# EAGLE schematic F405Pill (EAGLE 7.5.0)
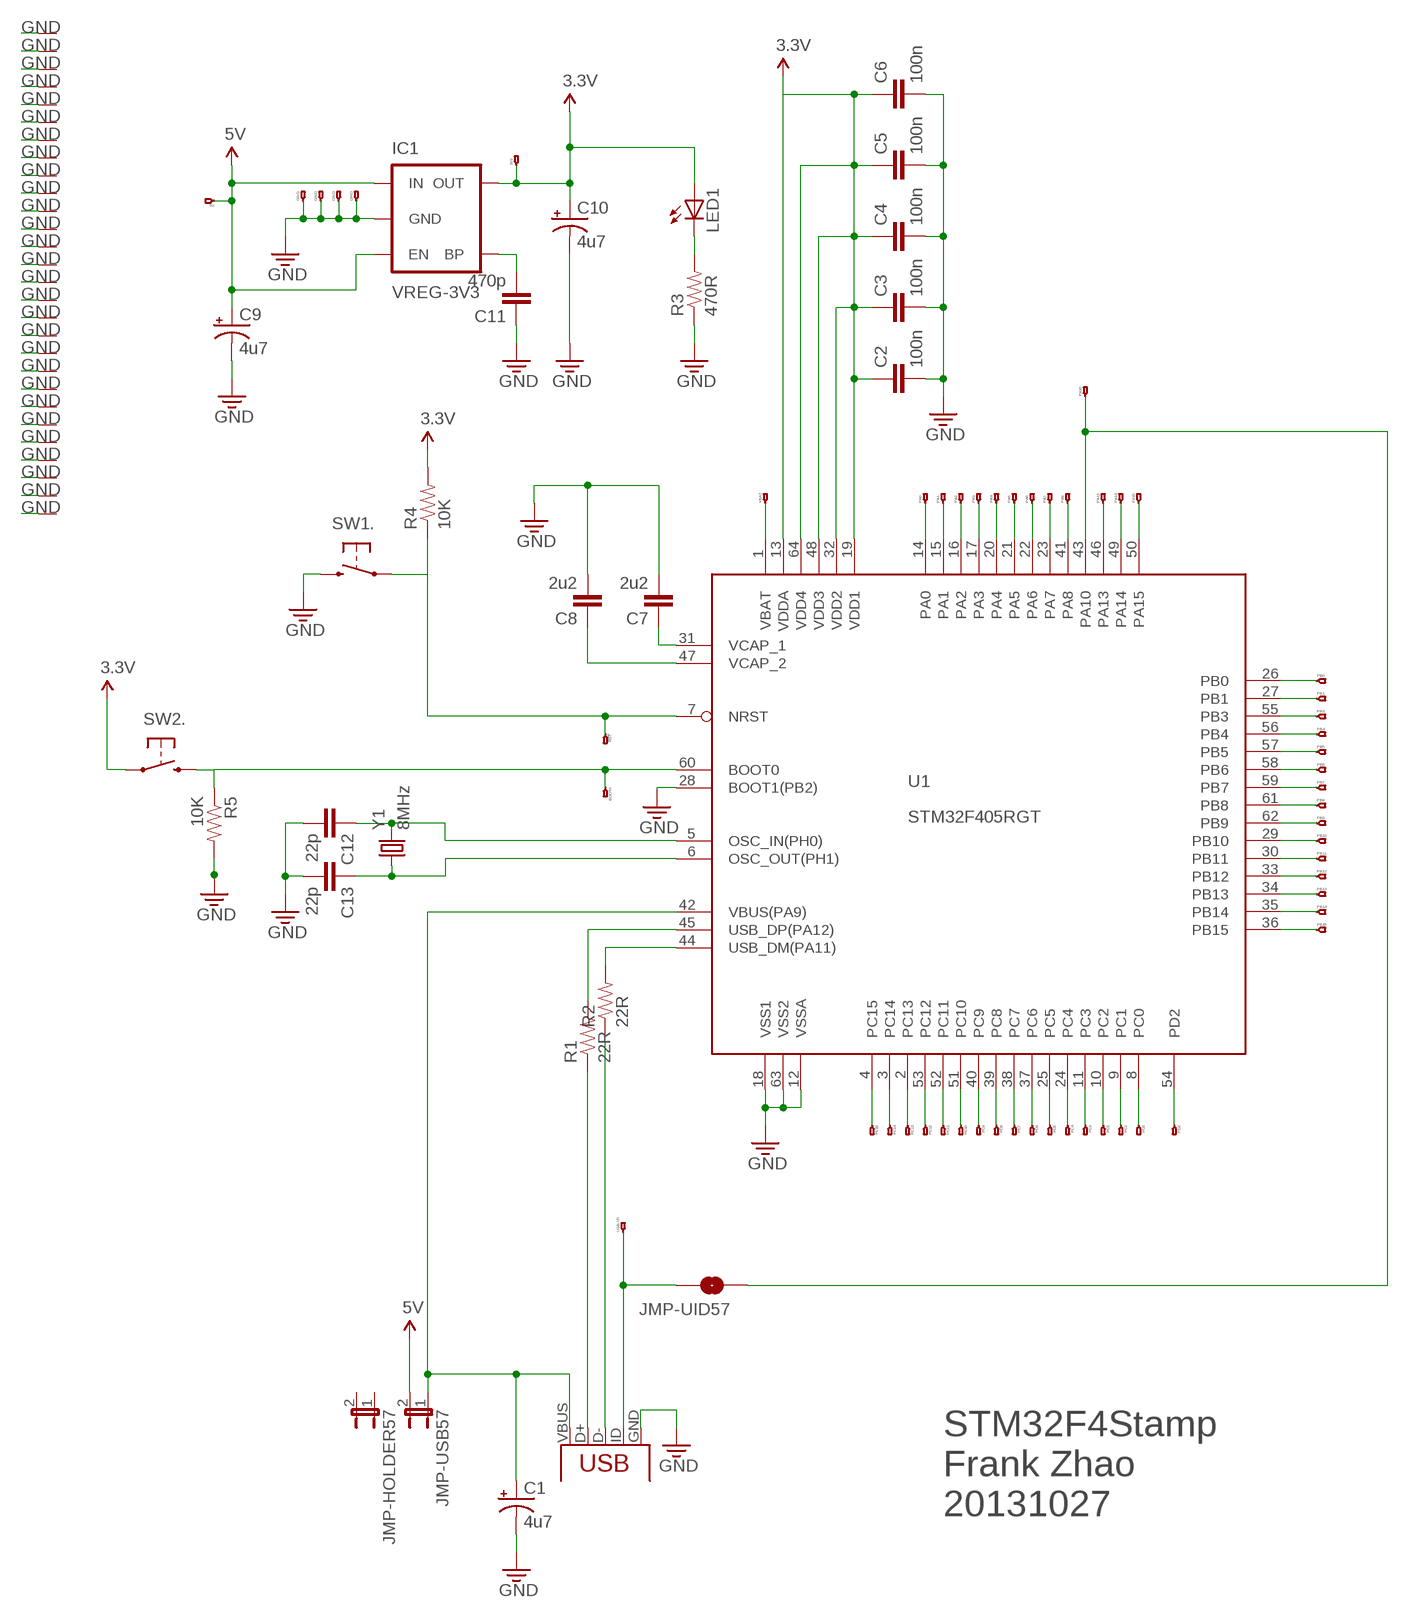
[diagram p0: schematic, sheet 1]

## Parts
C1  4u7  CAP_POL1206-KIT  [EIA3216-KIT]
C2  100n  CAP0603-CAP  [0603-CAP]
C3  100n  CAP0603-CAP  [0603-CAP]
C4  100n  CAP0603-CAP  [0603-CAP]
C5  100n  CAP0603-CAP  [0603-CAP]
C6  100n  CAP0603-CAP  [0603-CAP]
C7  2u2  CAP0603-CAP  [0603-CAP]
C8  2u2  CAP0603-CAP  [0603-CAP]
C9  4u7  CAP_POL1206-KIT  [EIA3216-KIT]
C10  4u7  CAP_POL1206-KIT  [EIA3216-KIT]
C11  470p  CAP0603-CAP  [0603-CAP]
C12  22p  CAP0603-CAP  [0603-CAP]
C13  22p  CAP0603-CAP  [0603-CAP]
IC1  VREG-3V3  V_REG_LDOSMD  [SOT23-5]
JMP-HOLDER57  JUMPER-2-PTH-2MM  [1X02_2MM_TH]
JMP-UID57  SOLDERJUMPERNC  [SJ_2S]
JMP-USB57  JUMPER-2-PTH-2MM  [1X02_2MM_TH]
JP2  5V  HEADERHOLE-HEADERHOLE  [1X1-HEADER-HOLE]
JP3  GND  HEADERHOLE-HEADERHOLE  [1X1-HEADER-HOLE]
JP4  3V3  HEADERHOLE-HEADERHOLE  [1X1-HEADER-HOLE]
JP5  GND  HEADERHOLE-HEADERHOLE  [1X1-HEADER-HOLE]
JP6  GND  HEADERHOLE-HEADERHOLE  [1X1-HEADER-HOLE]
JP7  GND  HEADERHOLE-HEADERHOLE  [1X1-HEADER-HOLE]
JP8  PB8  HEADERHOLE-HEADERHOLE  [1X1-HEADER-HOLE]
JP9  PA10  HEADERHOLE-HEADERHOLE  [1X1-HEADER-HOLE]
JP10  PA8  HEADERHOLE-HEADERHOLE  [1X1-HEADER-HOLE]
JP11  PA13  HEADERHOLE-HEADERHOLE  [1X1-HEADER-HOLE]
JP12  PC9  HEADERHOLE-HEADERHOLE  [1X1-HEADER-HOLE]
JP13  PC15  HEADERHOLE-HEADERHOLE  [1X1-HEADER-HOLE]
JP14  PC14  HEADERHOLE-HEADERHOLE  [1X1-HEADER-HOLE]
JP15  PC13  HEADERHOLE-HEADERHOLE  [1X1-HEADER-HOLE]
JP16  PC12  HEADERHOLE-HEADERHOLE  [1X1-HEADER-HOLE]
JP17  PC11  HEADERHOLE-HEADERHOLE  [1X1-HEADER-HOLE]
JP18  PC10  HEADERHOLE-HEADERHOLE  [1X1-HEADER-HOLE]
JP19  PC8  HEADERHOLE-HEADERHOLE  [1X1-HEADER-HOLE]
JP20  PC7  HEADERHOLE-HEADERHOLE  [1X1-HEADER-HOLE]
JP21  PC6  HEADERHOLE-HEADERHOLE  [1X1-HEADER-HOLE]
JP22  PC5  HEADERHOLE-HEADERHOLE  [1X1-HEADER-HOLE]
JP23  PC4  HEADERHOLE-HEADERHOLE  [1X1-HEADER-HOLE]
JP24  PC3  HEADERHOLE-HEADERHOLE  [1X1-HEADER-HOLE]
JP25  PC2  HEADERHOLE-HEADERHOLE  [1X1-HEADER-HOLE]
JP26  PC1  HEADERHOLE-HEADERHOLE  [1X1-HEADER-HOLE]
JP27  PC0  HEADERHOLE-HEADERHOLE  [1X1-HEADER-HOLE]
JP28  PD2  HEADERHOLE-HEADERHOLE  [1X1-HEADER-HOLE]
JP29  PA0  HEADERHOLE-HEADERHOLE  [1X1-HEADER-HOLE]
JP30  PA1  HEADERHOLE-HEADERHOLE  [1X1-HEADER-HOLE]
JP31  PA2  HEADERHOLE-HEADERHOLE  [1X1-HEADER-HOLE]
JP32  PA3  HEADERHOLE-HEADERHOLE  [1X1-HEADER-HOLE]
JP33  PA4  HEADERHOLE-HEADERHOLE  [1X1-HEADER-HOLE]
JP34  PA5  HEADERHOLE-HEADERHOLE  [1X1-HEADER-HOLE]
JP35  PA6  HEADERHOLE-HEADERHOLE  [1X1-HEADER-HOLE]
JP36  PA7  HEADERHOLE-HEADERHOLE  [1X1-HEADER-HOLE]
JP37  PA14  HEADERHOLE-HEADERHOLE  [1X1-HEADER-HOLE]
JP38  PA15  HEADERHOLE-HEADERHOLE  [1X1-HEADER-HOLE]
JP39  PB0  HEADERHOLE-HEADERHOLE  [1X1-HEADER-HOLE]
JP40  PB1  HEADERHOLE-HEADERHOLE  [1X1-HEADER-HOLE]
JP41  PB3  HEADERHOLE-HEADERHOLE  [1X1-HEADER-HOLE]
JP42  PB4  HEADERHOLE-HEADERHOLE  [1X1-HEADER-HOLE]
JP43  PB5  HEADERHOLE-HEADERHOLE  [1X1-HEADER-HOLE]
JP44  PB6  HEADERHOLE-HEADERHOLE  [1X1-HEADER-HOLE]
JP45  PB7  HEADERHOLE-HEADERHOLE  [1X1-HEADER-HOLE]
JP46  PB9  HEADERHOLE-HEADERHOLE  [1X1-HEADER-HOLE]
JP47  PB10  HEADERHOLE-HEADERHOLE  [1X1-HEADER-HOLE]
JP48  PB11  HEADERHOLE-HEADERHOLE  [1X1-HEADER-HOLE]
JP49  PB12  HEADERHOLE-HEADERHOLE  [1X1-HEADER-HOLE]
JP50  PB13  HEADERHOLE-HEADERHOLE  [1X1-HEADER-HOLE]
JP51  PB14  HEADERHOLE-HEADERHOLE  [1X1-HEADER-HOLE]
JP52  PB15  HEADERHOLE-HEADERHOLE  [1X1-HEADER-HOLE]
JP53  VBAT  HEADERHOLE-HEADERHOLE  [1X1-HEADER-HOLE]
JP54  !RST  HEADERHOLE-HEADERHOLE  [1X1-HEADER-HOLE]
JP55  BOOT0  HEADERHOLE-HEADERHOLE  [1X1-HEADER-HOLE]
JP56  USB-ID  HEADERHOLE-HEADERHOLE  [1X1-HEADER-HOLE]
LED1  LED0603  [LED-0603]
R1  22R  RESISTOR0603-RES  [0603-RES]
R2  22R  RESISTOR0603-RES  [0603-RES]
R3  470R  RESISTOR0603-RES  [0603-RES]
R4  10K  RESISTOR0603-RES  [0603-RES]
R5  10K  RESISTOR0603-RES  [0603-RES]
SW1  !RST  SWITCH-B3U-1110-BOSS  [SWITCH-TACT-B3U-1100P-B]
SW2  BOOT  SWITCH-B3U-1110-BOSS  [SWITCH-TACT-B3U-1100P-B]
U1  STM32F405RGT  [LQFP64]
USB57  USB-MICROB-SMD  [USB-MICROB-SMD]
VP_0  VPDEV0  [VPAC0]
VP_1  VPDEV0  [VPAC0]
VP_2  VPDEV0  [VPAC0]
VP_3  VPDEV0  [VPAC0]
VP_4  VPDEV0  [VPAC0]
VP_5  VPDEV0  [VPAC0]
VP_6  VPDEV0  [VPAC0]
VP_7  VPDEV0  [VPAC0]
VP_8  VPDEV0  [VPAC0]
VP_9  VPDEV0  [VPAC0]
VP_10  VPDEV0  [VPAC0]
VP_11  VPDEV0  [VPAC0]
VP_12  VPDEV0  [VPAC0]
VP_13  VPDEV0  [VPAC0]
VP_14  VPDEV0  [VPAC0]
VP_15  VPDEV0  [VPAC0]
VP_16  VPDEV0  [VPAC0]
VP_17  VPDEV0  [VPAC0]
VP_18  VPDEV0  [VPAC0]
VP_19  VPDEV0  [VPAC0]
VP_20  VPDEV0  [VPAC0]
VP_21  VPDEV0  [VPAC0]
VP_22  VPDEV0  [VPAC0]
VP_23  VPDEV0  [VPAC0]
VP_24  VPDEV0  [VPAC0]
VP_25  VPDEV0  [VPAC0]
VP_26  VPDEV0  [VPAC0]
VP_27  VPDEV0  [VPAC0]
Y1  8MHz  CRYSTAL5X3  [CRYSTAL-SMD-5X3]

## Nets
3.3V: C2.1 C3.1 C4.1 C5.1 C6.1 C10.A(+) IC1.5(OUT) JP4.1 LED1.A R4.2 SW2.1 U1.13(VDDA) U1.19(VDD1) U1.32(VDD2) U1.48(VDD3) U1.64(VDD4)
5V: C9.A(+) IC1.1(IN) IC1.3(EN) JMP-USB57.2 JP2.1
GND: C1.C(-) C2.2 C3.2 C4.2 C5.2 C6.2 C7.2 C8.2 C9.C(-) C10.C(-) C11.1 C12.2 C13.2 IC1.2(GND) JP3.1 JP5.1 JP6.1 JP7.1 R3.1 R5.2 SW1.2 SW1.BOSS SW2.BOSS U1.12(VSSA) U1.18(VSS1) U1.28(BOOT1(PB2)) U1.63(VSS2) USB57.GND USB57.MT1 USB57.MT2 USB57.MT3 USB57.MT4 VP_0.VP VP_1.VP VP_2.VP VP_3.VP VP_4.VP VP_5.VP VP_6.VP VP_7.VP VP_8.VP VP_9.VP VP_10.VP VP_11.VP VP_12.VP VP_13.VP VP_14.VP VP_15.VP VP_16.VP VP_17.VP VP_18.VP VP_19.VP VP_20.VP VP_21.VP VP_22.VP VP_23.VP VP_24.VP VP_25.VP VP_26.VP VP_27.VP
N$1: R1.2 U1.45(USB_DP(PA12))
N$2: R2.2 U1.44(USB_DM(PA11))
N$3: C1.A(+) JMP-USB57.1 U1.42(VBUS(PA9)) USB57.VBUS
N$4: JP12.1 U1.40(PC9)
N$5: R1.1 USB57.D+
N$6: R2.1 USB57.D-
N$7: JP8.1 U1.61(PB8)
N$8: C11.2 IC1.4(BP)
N$10: JP10.1 U1.41(PA8)
N$11: JP11.1 U1.46(PA13)
N$12: C13.1 U1.6(OSC_OUT(PH1)) Y1.1
N$13: C7.1 U1.31(VCAP_1)
N$14: C8.1 U1.47(VCAP_2)
N$15: C12.1 U1.5(OSC_IN(PH0)) Y1.3
N$16: JP55.1 R5.1 SW2.2 U1.60(BOOT0)
N$17: JP54.1 R4.1 SW1.1 U1.7(NRST)
N$18: LED1.C R3.2
N$20: JMP-UID57.2 JP56.1 USB57.ID
N$22: JMP-UID57.1 JP9.1 U1.43(PA10)
N$23: JP13.1 U1.4(PC15)
N$24: JP14.1 U1.3(PC14)
N$25: JP15.1 U1.2(PC13)
N$26: JP16.1 U1.53(PC12)
N$27: JP17.1 U1.52(PC11)
N$28: JP18.1 U1.51(PC10)
N$29: JP19.1 U1.39(PC8)
N$30: JP20.1 U1.38(PC7)
N$31: JP21.1 U1.37(PC6)
N$32: JP22.1 U1.25(PC5)
N$33: JP23.1 U1.24(PC4)
N$34: JP24.1 U1.11(PC3)
N$35: JP25.1 U1.10(PC2)
N$36: JP26.1 U1.9(PC1)
N$37: JP27.1 U1.8(PC0)
N$38: JP28.1 U1.54(PD2)
N$39: JP29.1 U1.14(PA0)
N$40: JP30.1 U1.15(PA1)
N$41: JP31.1 U1.16(PA2)
N$42: JP32.1 U1.17(PA3)
N$43: JP33.1 U1.20(PA4)
N$44: JP34.1 U1.21(PA5)
N$45: JP35.1 U1.22(PA6)
N$46: JP36.1 U1.23(PA7)
N$47: JP37.1 U1.49(PA14)
N$48: JP38.1 U1.50(PA15)
N$49: JP39.1 U1.26(PB0)
N$50: JP40.1 U1.27(PB1)
N$51: JP41.1 U1.55(PB3)
N$52: JP42.1 U1.56(PB4)
N$53: JP43.1 U1.57(PB5)
N$54: JP44.1 U1.58(PB6)
N$55: JP45.1 U1.59(PB7)
N$56: JP46.1 U1.62(PB9)
N$57: JP47.1 U1.29(PB10)
N$58: JP48.1 U1.30(PB11)
N$59: JP49.1 U1.33(PB12)
N$60: JP50.1 U1.34(PB13)
N$61: JP51.1 U1.35(PB14)
N$62: JP52.1 U1.36(PB15)
N$63: JP53.1 U1.1(VBAT)
Unconnected: JMP-HOLDER57.1 JMP-HOLDER57.2

## Notes on the sheet
- STM32F4Stamp
  Frank Zhao
  20131027

## Library data of the parts
C1 C9 C10 = stm32f4stamp:CAP_POL: Capacitor Polarized These are standard SMD and PTH capacitors. Normally 10uF, 47uF, and 100uF in electrolytic and tantalum varieties. Always verify the external diameter of the through hole cap, it varies with capacity, voltage, and manufacturer. The EIA devices should be standard.
C2-C8 C11-C13 = stm32f4stamp:CAP: Capacitor Standard 0603 ceramic capacitor, and 0.1" leaded capacitor.
IC1 = stm32f4stamp:V_REG_LDO: Voltage Regulator LDO Standard 150mA LDO voltage regulator in SOT-23 layout. Micrel part MIC5205. BP (by-pass) pin is used to lower output noise with 470pF cap.
JMP-HOLDER57 JMP-USB57 = stm32f4stamp:JUMPER-2: Jumper Basic 0.1" spaced jumper. Use with breakaway headers.
JMP-UID57 = stm32f4stamp:SOLDERJUMPER: Solder Jumper Standard SMD solder jumper. Used to automate production. Two varients : Normally Open and Normally Closed are the same, but have different paste layers. NC will have a large amount of paste and should jumper during reflow.
JP2-JP56 = stm32f4stamp:HEADERHOLE
LED1 = stm32f4stamp:LED: LEDs Standard schematic elements and footprints for 5mm, 3mm, 1206, and 0603 sized LEDs. 5mm - Spark Fun Electronics SKU : COM-00529 (and others)
R1-R5 = stm32f4stamp:RESISTOR: Resistor Basic schematic elements and footprints for 0603, 1206, and PTH resistors.
SW1 SW2 = stm32f4stamp:SWITCH-B3U-1110
U1 = stm32f4stamp:STM32F405RGT
USB57 = stm32f4stamp:USB: USB Connectors USB-B-PTH is fully proven SKU : PRT-00139 USB-miniB is fully proven SKU : PRT-00587 USB-A-PCB is untested. USB-A-H is throughly reviewed, but untested. Spark Fun Electronics SKU : PRT-00437 USB-B-SMT is throughly reviewed, but untested. Needs silkscreen touching up. USB-A-S has not been used/tested USB-MB-H has not been used/tested
VP_0 VP_1-VP_27 = vpad:VPDEV0: VIAPAD
Y1 = stm32f4stamp:CRYSTAL: Crystals Various standard crystals. Proven footprints. Spark Fun Electronics SKU : COM-00534